# EAGLE design Heaters (EAGLE 7.7.0)

## Sheet 1 of 2
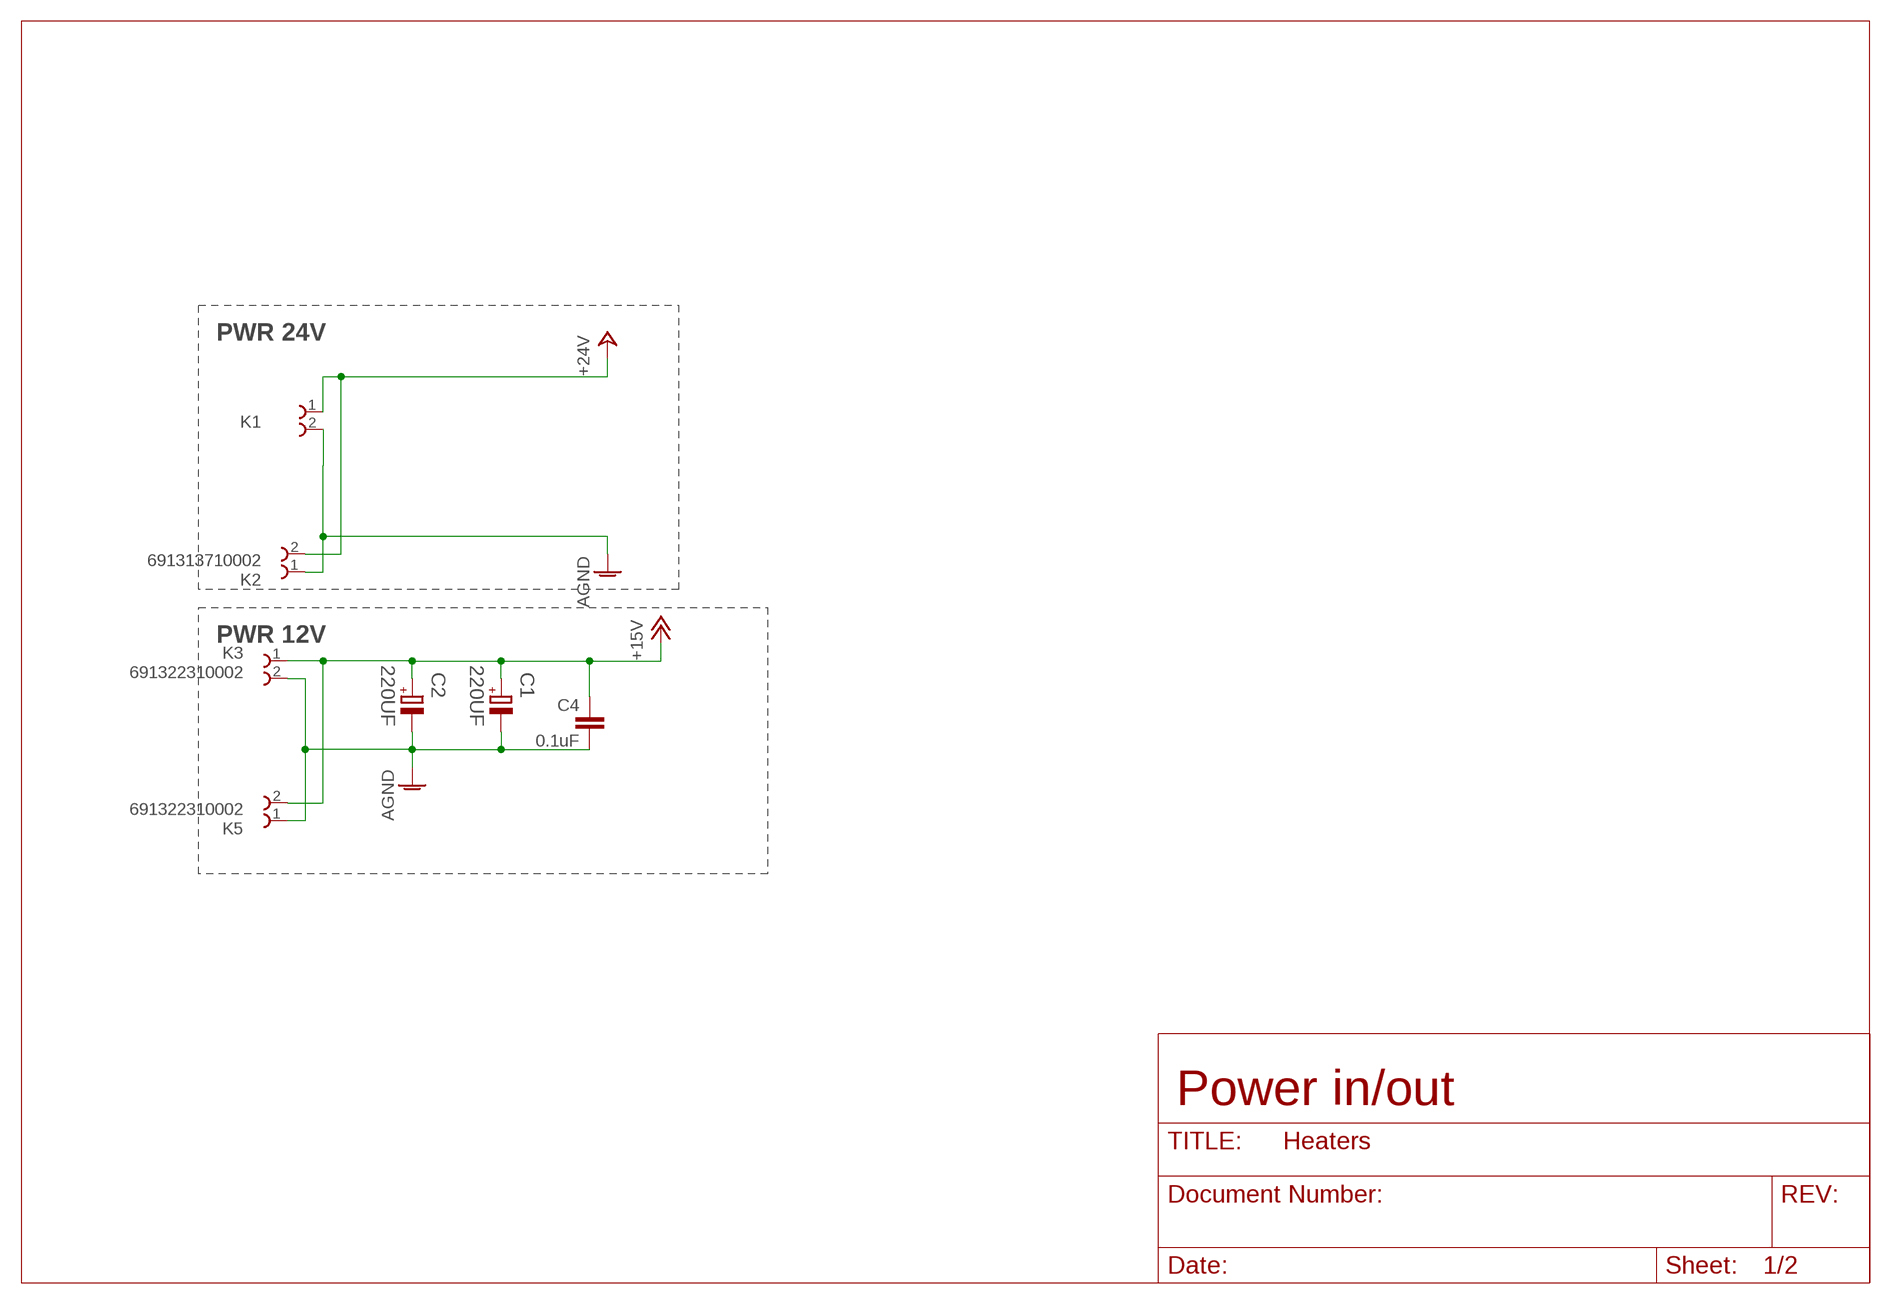
[diagram p0: schematic, sheet 1]

### Parts
C1  220UF  EEE-FP1V221AP-CASE-F  [CAPAE830X1050N]
C2  220UF  EEE-FP1V221AP-CASE-F  [CAPAE830X1050N]
C4  0.1uF  C-EUC0603K  [C0603K]
K1  691313710002  [691313710002]
K2  691313710002  [691313710002]
K3  691322310002  [691322310002]
K5  691322310002  [691322310002]

### Nets
+15V: C1.1 C2.1 C4.2 K3.1 K5.2 ; also sheet 2
+24V: K1.1 K2.2 ; also sheet 2
AGND: C1.2 C2.2 C4.1 K1.2 K2.1 K3.2 K5.1 ; also sheet 2

### Notes on the sheet
- PWR 24V
- PWR 12V
- Power in/out

## Sheet 2 of 2
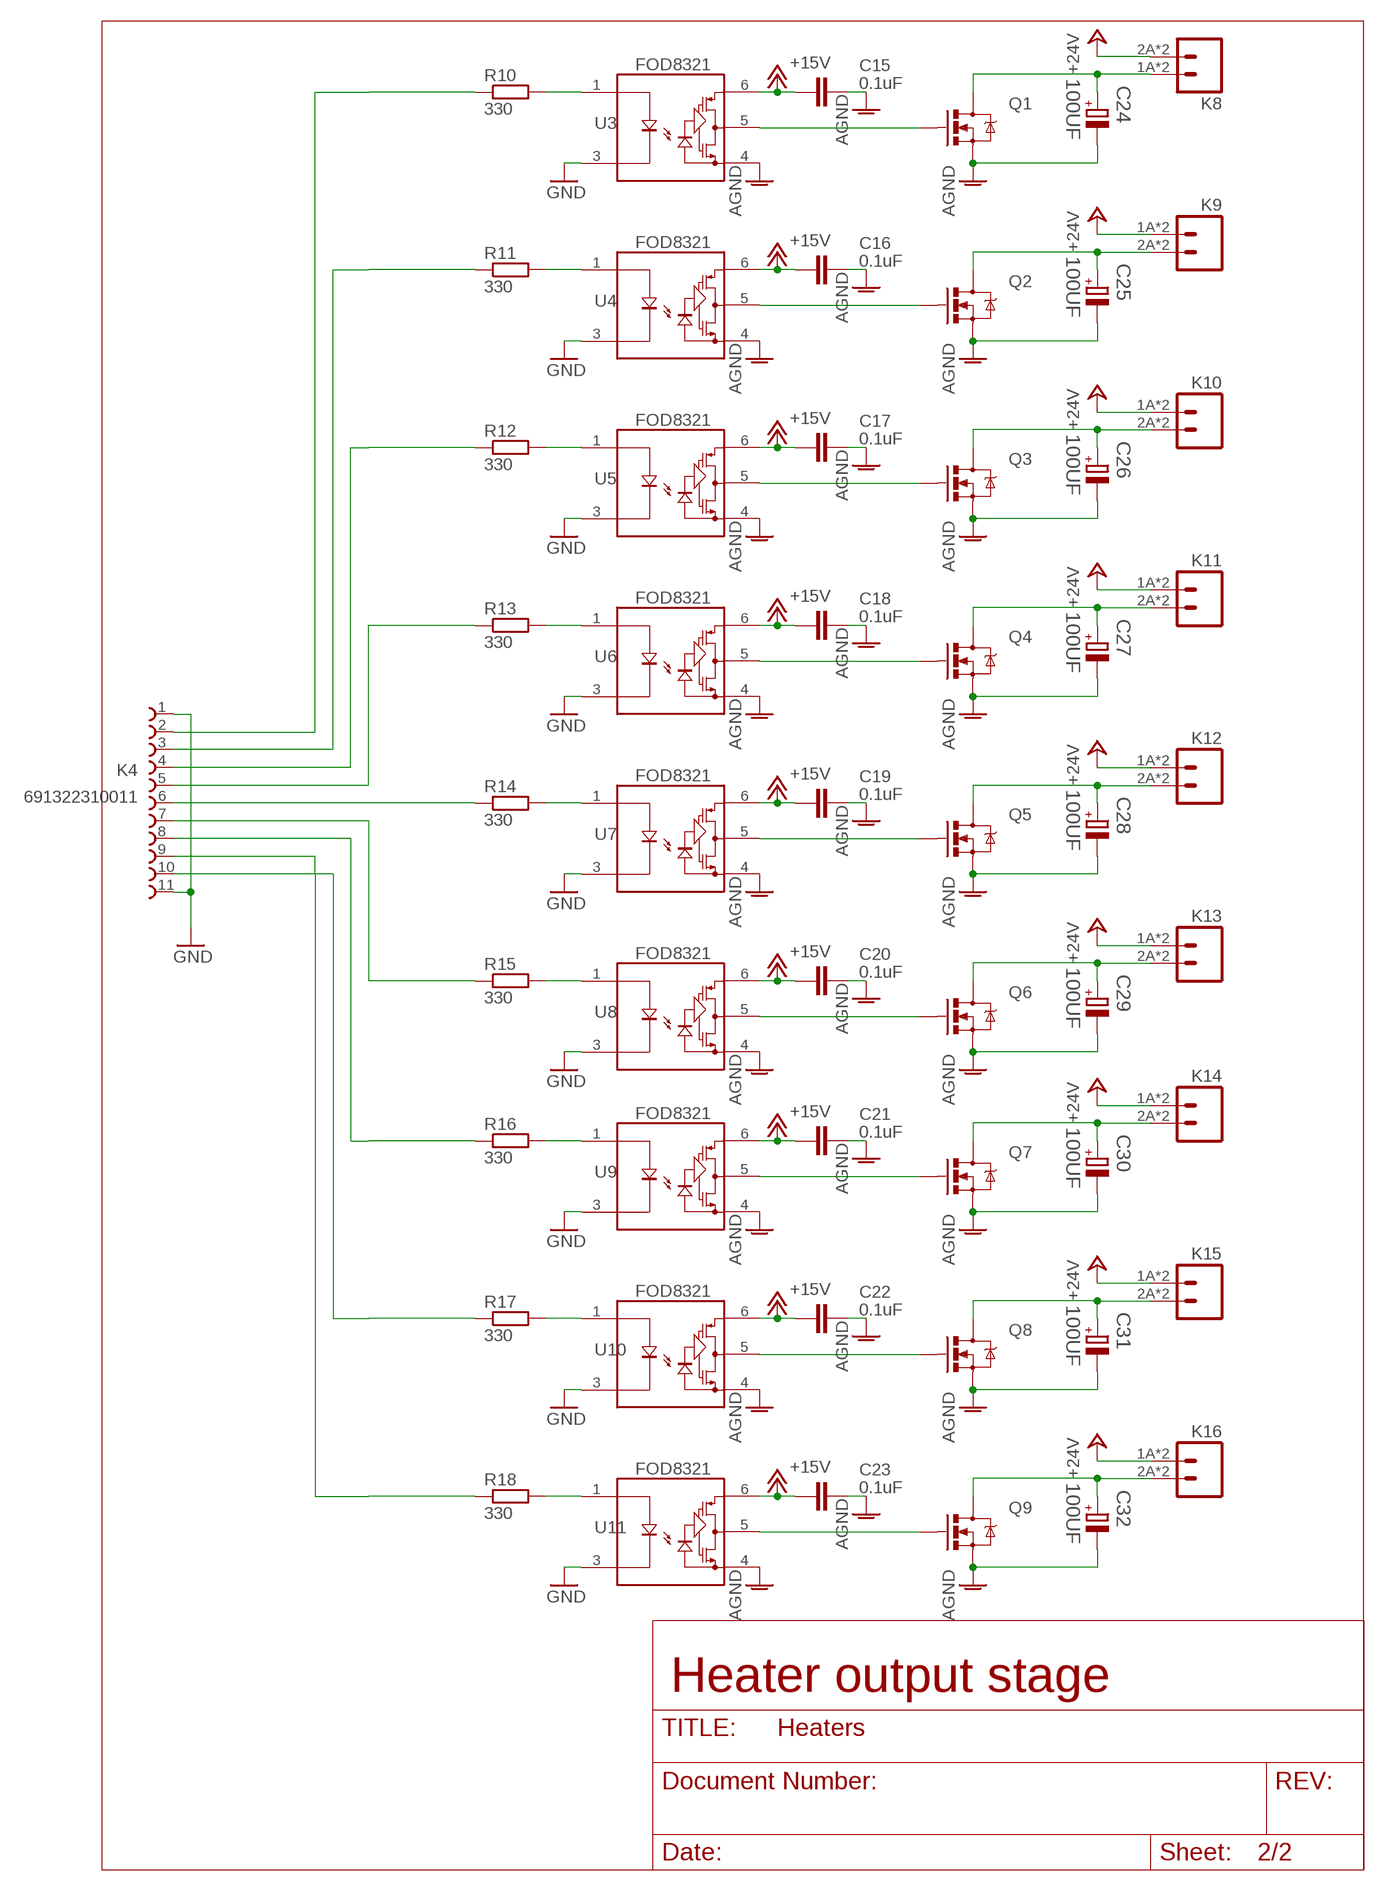
[diagram p1: schematic, sheet 2]

### Parts
C15  0.1uF  C-EUC1206K  [C1206K]
C16  0.1uF  C-EUC1206K  [C1206K]
C17  0.1uF  C-EUC1206K  [C1206K]
C18  0.1uF  C-EUC1206K  [C1206K]
C19  0.1uF  C-EUC1206K  [C1206K]
C20  0.1uF  C-EUC1206K  [C1206K]
C21  0.1uF  C-EUC1206K  [C1206K]
C22  0.1uF  C-EUC1206K  [C1206K]
C23  0.1uF  C-EUC1206K  [C1206K]
C24  100UF  EEE-FK2A101AM-CASE-J16  [CAPAE1700X1700N]
C25  100UF  EEE-FK2A101AM-CASE-J16  [CAPAE1700X1700N]
C26  100UF  EEE-FK2A101AM-CASE-J16  [CAPAE1700X1700N]
C27  100UF  EEE-FK2A101AM-CASE-J16  [CAPAE1700X1700N]
C28  100UF  EEE-FK2A101AM-CASE-J16  [CAPAE1700X1700N]
C29  100UF  EEE-FK2A101AM-CASE-J16  [CAPAE1700X1700N]
C30  100UF  EEE-FK2A101AM-CASE-J16  [CAPAE1700X1700N]
C31  100UF  EEE-FK2A101AM-CASE-J16  [CAPAE1700X1700N]
C32  100UF  EEE-FK2A101AM-CASE-J16  [CAPAE1700X1700N]
K4  691322310011  [691322310011]
K8  M02-MOLEX-104188-0210  [LITE-TRAP-CONNECTOR-2]
K9  M02-MOLEX-104188-0210  [LITE-TRAP-CONNECTOR-2]
K10  M02-MOLEX-104188-0210  [LITE-TRAP-CONNECTOR-2]
K11  M02-MOLEX-104188-0210  [LITE-TRAP-CONNECTOR-2]
K12  M02-MOLEX-104188-0210  [LITE-TRAP-CONNECTOR-2]
K13  M02-MOLEX-104188-0210  [LITE-TRAP-CONNECTOR-2]
K14  M02-MOLEX-104188-0210  [LITE-TRAP-CONNECTOR-2]
K15  M02-MOLEX-104188-0210  [LITE-TRAP-CONNECTOR-2]
K16  M02-MOLEX-104188-0210  [LITE-TRAP-CONNECTOR-2]
Q1  MOSFET-NCHANNEL-FDMS5672  [POWERPACK5060-8]
Q2  MOSFET-NCHANNEL-FDMS5672  [POWERPACK5060-8]
Q3  MOSFET-NCHANNEL-FDMS5672  [POWERPACK5060-8]
Q4  MOSFET-NCHANNEL-FDMS5672  [POWERPACK5060-8]
Q5  MOSFET-NCHANNEL-FDMS5672  [POWERPACK5060-8]
Q6  MOSFET-NCHANNEL-FDMS5672  [POWERPACK5060-8]
Q7  MOSFET-NCHANNEL-FDMS5672  [POWERPACK5060-8]
Q8  MOSFET-NCHANNEL-FDMS5672  [POWERPACK5060-8]
Q9  MOSFET-NCHANNEL-FDMS5672  [POWERPACK5060-8]
R10  330  R-EU_R0603  [R0603]
R11  330  R-EU_R0603  [R0603]
R12  330  R-EU_R0603  [R0603]
R13  330  R-EU_R0603  [R0603]
R14  330  R-EU_R0603  [R0603]
R15  330  R-EU_R0603  [R0603]
R16  330  R-EU_R0603  [R0603]
R17  330  R-EU_R0603  [R0603]
R18  330  R-EU_R0603  [R0603]
U3  FOD8321  [WB-SOP5]
U4  FOD8321  [WB-SOP5]
U5  FOD8321  [WB-SOP5]
U6  FOD8321  [WB-SOP5]
U7  FOD8321  [WB-SOP5]
U8  FOD8321  [WB-SOP5]
U9  FOD8321  [WB-SOP5]
U10  FOD8321  [WB-SOP5]
U11  FOD8321  [WB-SOP5]

### Nets
+15V: C15.1 C16.1 C17.1 C18.1 C19.1 C20.1 C21.1 C22.1 C23.1 U3.6(VDD) U4.6(VDD) U5.6(VDD) U6.6(VDD) U7.6(VDD) U8.6(VDD) U9.6(VDD) U10.6(VDD) U11.6(VDD) ; also sheet 1
+24V: K8.2A K8.2B K9.1A K9.1B K10.1A K10.1B K11.1A K11.1B K12.1A K12.1B K13.1A K13.1B K14.1A K14.1B K15.1A K15.1B K16.1A K16.1B ; also sheet 1
AGND: C15.2 C16.2 C17.2 C18.2 C19.2 C20.2 C21.2 C22.2 C23.2 C24.2 C25.2 C26.2 C27.2 C28.2 C29.2 C30.2 C31.2 C32.2 Q1.S1(S) Q1.S2(S) Q1.S3(S) Q2.S1(S) Q2.S2(S) Q2.S3(S) Q3.S1(S) Q3.S2(S) Q3.S3(S) Q4.S1(S) Q4.S2(S) Q4.S3(S) Q5.S1(S) Q5.S2(S) Q5.S3(S) Q6.S1(S) Q6.S2(S) Q6.S3(S) Q7.S1(S) Q7.S2(S) Q7.S3(S) Q8.S1(S) Q8.S2(S) Q8.S3(S) Q9.S1(S) Q9.S2(S) Q9.S3(S) U3.4(VSS) U4.4(VSS) U5.4(VSS) U6.4(VSS) U7.4(VSS) U8.4(VSS) U9.4(VSS) U10.4(VSS) U11.4(VSS) ; also sheet 1
GND: K4.1 K4.11 U3.3(K) U4.3(K) U5.3(K) U6.3(K) U7.3(K) U8.3(K) U9.3(K) U10.3(K) U11.3(K)
N$1: R18.2 U11.1(A)
N$2: R17.2 U10.1(A)
N$3: C24.1 K8.1A K8.1B Q1.D5(D) Q1.D6(D) Q1.D7(D) Q1.D8(D) Q1.DPAD(D)
N$4: R11.2 U4.1(A)
N$6: C25.1 K9.2A K9.2B Q2.D5(D) Q2.D6(D) Q2.D7(D) Q2.D8(D) Q2.DPAD(D)
N$7: R12.2 U5.1(A)
N$8: C26.1 K10.2A K10.2B Q3.D5(D) Q3.D6(D) Q3.D7(D) Q3.D8(D) Q3.DPAD(D)
N$9: R13.2 U6.1(A)
N$10: R10.2 U3.1(A)
N$11: C27.1 K11.2A K11.2B Q4.D5(D) Q4.D6(D) Q4.D7(D) Q4.D8(D) Q4.DPAD(D)
N$12: R14.2 U7.1(A)
N$13: C28.1 K12.2A K12.2B Q5.D5(D) Q5.D6(D) Q5.D7(D) Q5.D8(D) Q5.DPAD(D)
N$14: R15.2 U8.1(A)
N$15: C29.1 K13.2A K13.2B Q6.D5(D) Q6.D6(D) Q6.D7(D) Q6.D8(D) Q6.DPAD(D)
N$16: R16.2 U9.1(A)
N$17: C30.1 K14.2A K14.2B Q7.D5(D) Q7.D6(D) Q7.D7(D) Q7.D8(D) Q7.DPAD(D)
N$18: C31.1 K15.2A K15.2B Q8.D5(D) Q8.D6(D) Q8.D7(D) Q8.D8(D) Q8.DPAD(D)
N$19: C32.1 K16.2A K16.2B Q9.D5(D) Q9.D6(D) Q9.D7(D) Q9.D8(D) Q9.DPAD(D)
PWM_DOT1: K4.10 R17.1
PWM_DOT2: K4.9 R18.1
PWM_SEG1: K4.2 R10.1
PWM_SEG2: K4.3 R11.1
PWM_SEG3: K4.4 R12.1
PWM_SEG4: K4.5 R13.1
PWM_SEG5: K4.6 R14.1
PWM_SEG6: K4.7 R15.1
PWM_SEG7: K4.8 R16.1
VO: Q1.G4(G) U3.5(VO)
VO1: Q2.G4(G) U4.5(VO)
VO2: Q3.G4(G) U5.5(VO)
VO3: Q4.G4(G) U6.5(VO)
VO4: Q5.G4(G) U7.5(VO)
VO5: Q6.G4(G) U8.5(VO)
VO6: Q7.G4(G) U9.5(VO)
VO7: Q9.G4(G) U11.5(VO)
VO8: Q8.G4(G) U10.5(VO)

### Notes on the sheet
- Heater output stage

## Library data of the parts
C1 C2 = Panasonic-EEEFK_EEEFP:EEE-: Aluminum Electrolytic Capacitors,Surface Mount Type; MPN: EEE-FP1V221AP; OC_FARNELL: 1539514; OC_NEWARK: 94M7043; PACKAGE: CASE-F; SUPPLIER: PANASONIC; TOLERANCE: ±20 %; VOLTAGERATING: 35V
C4 C15-C23 = rcl:C-EU: CAPACITOR, European symbol
C24-C32 = Panasonic-EEEFK_EEEFP:EEE-: Aluminum Electrolytic Capacitors,Surface Mount Type; MPN: EEE-FK2A101AM; OC_FARNELL: 2284678; OC_NEWARK: 53W3690; PACKAGE: CASE-J16; SUPPLIER: PANASONIC; TOLERANCE: ±20 %; VOLTAGERATING: 100V
K1 K2 = Wurth_Elektronik_Electromechanic_Terminal_Blocks_Connectors_rev15d:691313710002: WR-TBL Serie 3137 - 5.0mm Close Horizontal PCB Header , 2 Pins=>Code : Con_TBL_Pluggable_5.00_PCB_H_691313710002 <http://katalog.we-online.de/media/images/eican/Con_TBL_Pluggable_5.00_PCB_H_6913137100xx_pf2.jpg> Details see: http://katalog.we-online.de/en/em/691_313_710_0xx Created 2014-06-19, Karrer Zheng 2014 (C) Würth Elektronik
K3 K5 = Wurth_Elektronik_Electromechanic_Terminal_Blocks_Connectors_rev15d:691322310002: WR-TBL Serie 322 - 3.81mm Vertical PCB Header , 2 Pins=>Code : Con_TBL_Pluggable_3.81_PCB_THT_Simple_691322310002 <http://katalog.we-online.de/media/images/eican/Con_TBL_Pluggable_3.81_PCB_THT_Simple_6913223100xx_pf2.jpg> Details see: http://katalog.we-online.de/en/em/691_322_310_0xx Created 2014-06-19, Karrer Zheng 2014 (C) Würth Elektronik
K4 = Wurth_Elektronik_Electromechanic_Terminal_Blocks_Connectors_rev15d:691322310011: WR-TBL Serie 322 - 3.81mm Vertical PCB Header , 11 Pins=>Code : Con_TBL_Pluggable_3.81_PCB_THT_Simple_691322310011 <http://katalog.we-online.de/media/images/eican/Con_TBL_Pluggable_3.81_PCB_THT_Simple_6913223100xx_pf2.jpg> Details see: http://katalog.we-online.de/en/em/691_322_310_0xx Created 2014-06-19, Karrer Zheng 2014 (C) Würth Elektronik
K8-K16 = simbits:M02: Standard 2-pin 0.1" header. Use with - straight break away headers ( PRT-00116) - right angle break away headers (PRT-00553) - swiss pins (PRT-00743) - machine pins (PRT-00117) - female headers (PRT-00115) Molex polarized connector foot print use with: PRT-08233 with associated crimp pins and housings. 2.54_SCREWTERM for use with PRT-10571. 3.5mm Screw Terminal footprints for PRT-08084 5mm Screw Terminal footprints for use with PRT-08432
Q1-Q9 = simbits:MOSFET-NCHANNEL: Common NMOSFET Parts MFG P/N Store ID Prod ID FDD8780 TRANS-09984 SI7820DN TRANS-11055 FDS6630A IC-08089 2N7002PW TRANS-11151 FQP30N06L COM-10213 TRANS-10060 BSS123LT1G TRANS-08345 BSS138 TRANS-00830 BS170 2N7000
R10-R18 = rcl:R-EU_: RESISTOR, European symbol
U3-U11 = simbits:FOD8321: Fairchild FOD8321 2.5A Output Current, Gate Drive Optocoupler in Optoplanar® Wide Body SOP 5-Pin Push-Pull output

## Board
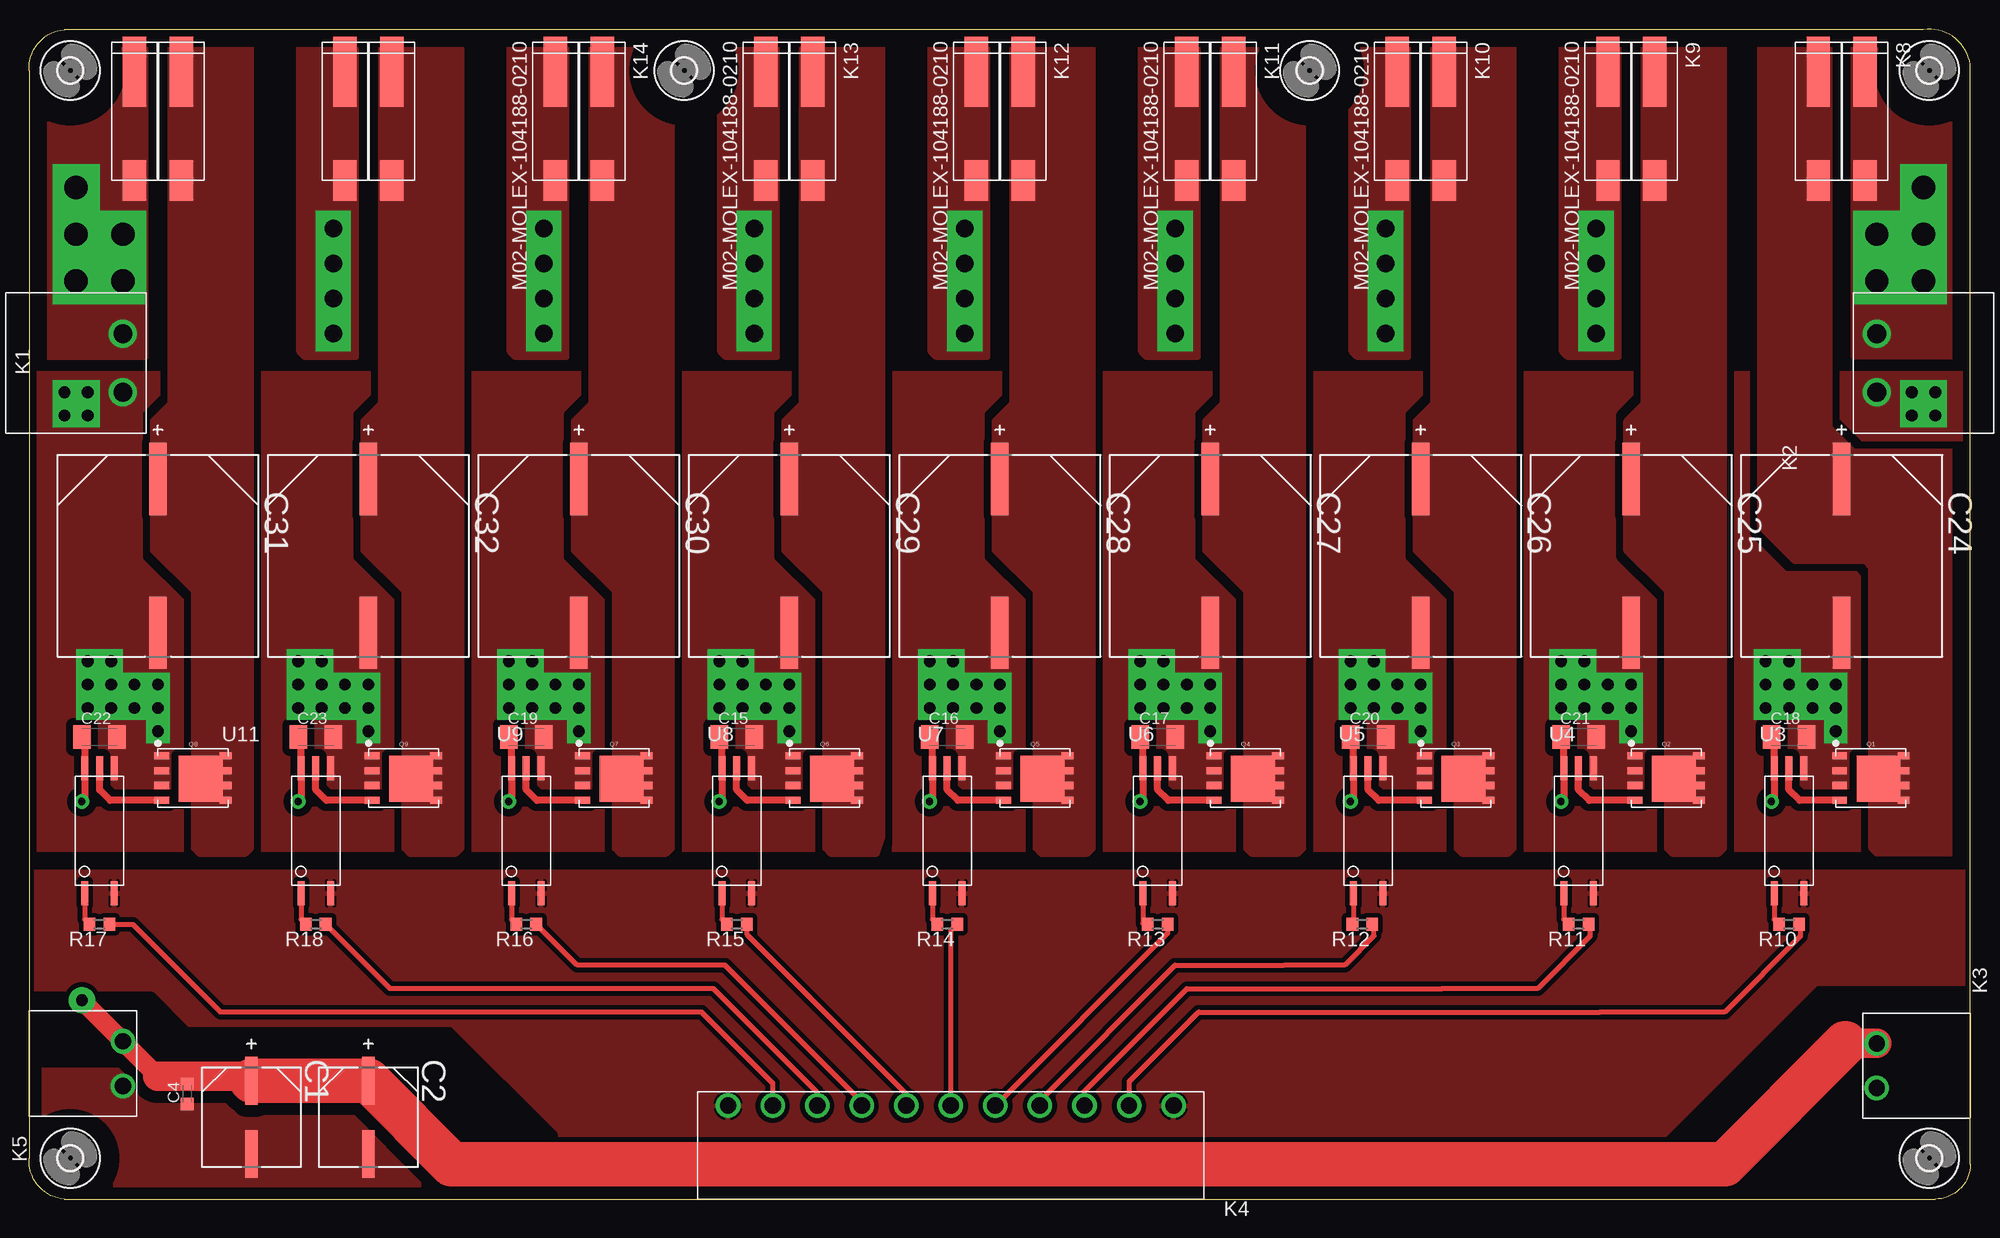
[diagram p2: board, top side]
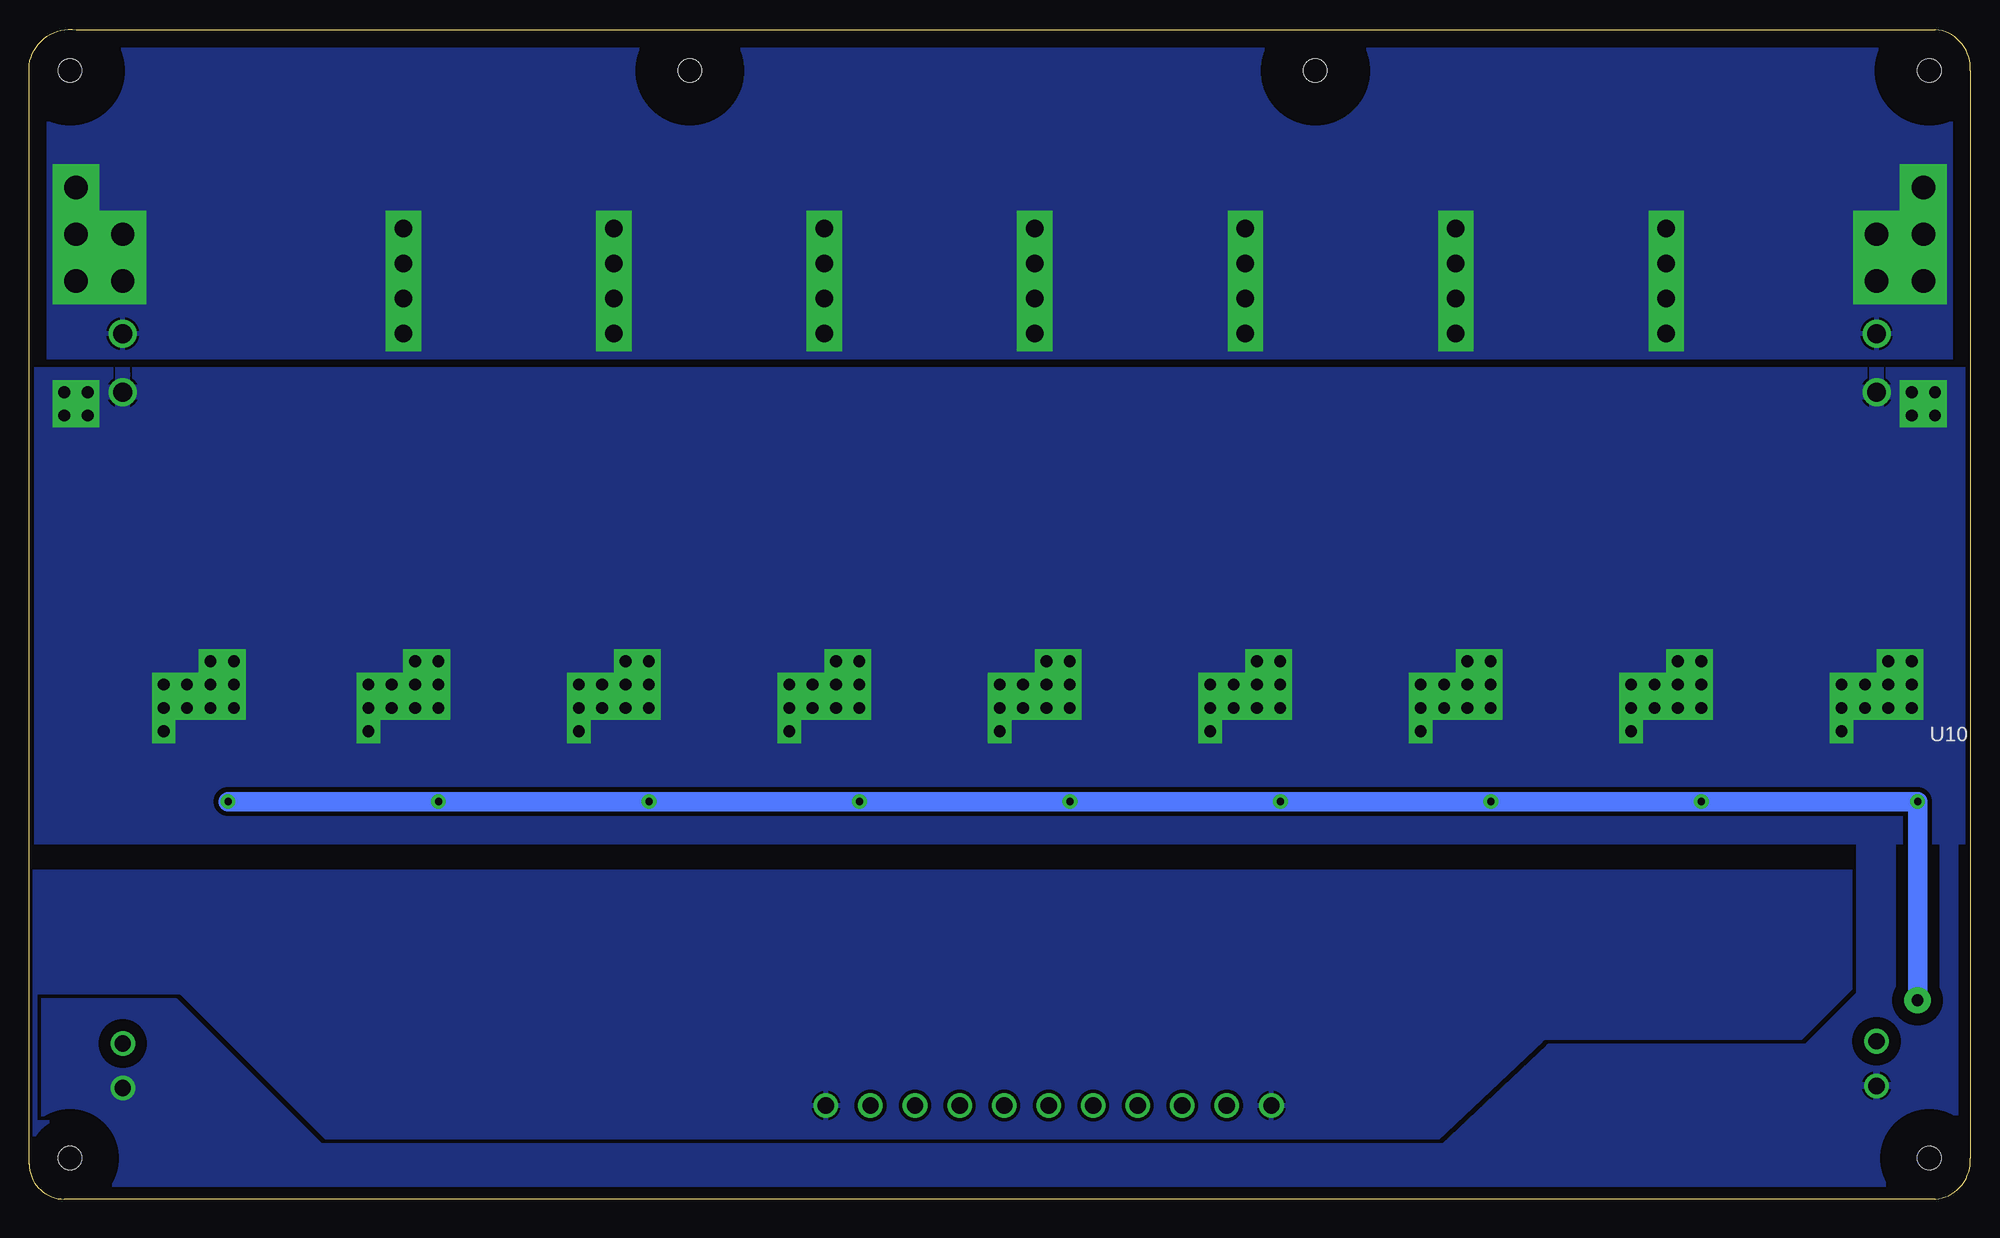
[diagram p3: board, bottom side, seen from below]

Size 166.01 x 100.03 mm. Coordinates in mm from the lower left corner, seen from the top.
Outline: 3.01,0 163.01,0 arc90 166.01,3 166.01,97 arc90 162.01,100 3.01,100 arc90 0.01,96.5 0.01,3.5 arc90 3.01,0
Copper layers (1*16): Top 0.035mm / dielectric 1.55mm / Bottom 0.035mm
Design rules "eC_2Layer_PClass6_BaseCopperO35 *": minimum track width 0.15mm, minimum drill 0.35mm, track to track 0.175mm, track to pad 0.175mm, pad to pad 0.175mm, via to via 0.175mm, smd to smd 0mil, copper to edge 0.25mm, drill to drill 0.35mm, minimum pad ring 0.175mm, minimum via ring 0.125mm, stop-mask expansion 0mil, vias tented up to drill 0.45mm, thermal gap 0.2mm

### Footprints (pad centres in the part's own frame; a part is rotated, then mirrored left to right if it is on the bottom)
2,0 = hole 2: 0,0
CAPAE830X1050N = smd 4.064 x 1.092: 1 -3.124,0; 2 3.124,0
C0603K = smd 1.05 x 1.08: 1 -0.875,0; 2 0.875,0
C1206K = smd 1.5 x 2: 1 -1.5,0; 2 1.5,0
CAPAE1700X1700N = smd 6.172 x 1.499: 1 -6.579,0; 2 6.579,0
691313710002 = drill 1.6: 1 -5,0; 2 0,0
691322310002 = drill 1.4: 1 -3.81,0; 2 0,0
691322310011 = drill 1.4: 1 -22.86,0; 2 -19.05,0; 3 -15.24,0; 4 -11.43,0; 5 -7.62,0; 6 -3.81,0; 7 0,0; 8 3.81,0; 9 7.62,0; 10 11.43,0; 11 15.24,0
LITE-TRAP-CONNECTOR-2 = smd 6 x 2: 1A -3.4,-2; 2A -3.4,2 | smd 3.5 x 2: 1B 5.9,-2; 2B 5.9,2
POWERPACK5060-8 = smd 1.02 x 0.61: D5 2.79,-1.905; D8 2.79,1.905 | smd 0.77 x 0.61: D6 2.915,-0.635; D7 2.915,0.635 | smd 3.75 x 3.91: DPAD 0.65,-0.05 | smd 1.27 x 0.61: G4 -2.675,-1.905; S1 -2.675,1.905; S2 -2.675,0.635; S3 -2.675,-0.635
R0603 = smd 1 x 1.1: 1 -0.85,0; 2 0.85,0
WB-SOP5 = smd 0.6 x 2.05: 1 -1.27,-5.35; 3 1.27,-5.35; 4 1.27,5.35; 5 0,5.35; 6 -1.27,5.35

### Placement (x,y rotation side)
$2_206_$_2016-11-07_20-18-07  MOUNT-HOLE2.0  [2,0]  3.51,96.5 0 top
C1  19.01,7 270 top
C2  29.01,7 270 top
C4  13.51,9 90 top
C15  60.51,39.5 0 top
C16  78.51,39.5 0 top
C17  96.51,39.5 0 top
C18  150.51,39.5 0 top
C19  42.51,39.5 0 top
C20  114.51,39.5 0 top
C21  132.51,39.5 0 top
C22  6.01,39.5 0 top
C23  24.51,39.5 0 top
C24  155.01,55 270 top
C25  137.01,55 270 top
C26  119.01,55 270 top
C27  101.01,55 270 top
C28  83.01,55 270 top
C29  65.01,55 270 top
C30  47.01,55 270 top
C31  11.01,55 270 top
C32  29.01,55 270 top
H1  MOUNT-HOLE2.0  [2,0]  3.51,3.5 0 top
H2  MOUNT-HOLE2.0  [2,0]  162.51,3.5 0 top
H6  MOUNT-HOLE2.0  [2,0]  162.51,96.5 0 top
H7  MOUNT-HOLE2.0  [2,0]  56.01,96.5 0 top
H8  MOUNT-HOLE2.0  [2,0]  109.51,96.5 0 top
K1  8.01,69 270 top
K2  158.01,74 90 top
K3  158.01,9.5 270 top
K4  75.01,8 180 top
K5  8.01,13.5 90 top
K8  155.01,93 270 top
K9  137.01,93 270 top
K10  119.01,93 270 top
K11  101.01,93 270 top
K12  83.01,93 270 top
K13  65.01,93 270 top
K14  47.01,93 270 top
K15  11.01,93 270 top
K16  29.01,93 270 top
Q1  157.51,36 0 top
Q2  140.01,36 0 top
Q3  122.01,36 0 top
Q4  104.01,36 0 top
Q5  86.01,36 0 top
Q6  68.01,36 0 top
Q7  50.01,36 0 top
Q8  14.01,36 0 top
Q9  32.01,36 0 top
R10  150.51,23.5 180 top
R11  132.51,23.5 180 top
R12  114.01,23.5 180 top
R13  96.51,23.5 180 top
R14  78.51,23.5 180 top
R15  60.51,23.5 180 top
R16  42.51,23.5 180 top
R17  6.01,23.5 180 top
R18  24.51,23.5 180 top
U3  150.51,31.5 0 top
U4  132.51,31.5 0 top
U5  114.51,31.5 0 top
U6  96.51,31.5 0 top
U7  78.51,31.5 0 top
U8  60.51,31.5 0 top
U9  42.51,31.5 0 top
U10  6.01,31.5 0 top
U11  24.51,31.5 0 top

### Tracks (layer width: path | path; a pad name or v marks a point on that pad's centre or on a via)
+15V  (via drill 0.6 pad 1.27, 1 pad 2.25)
  Top 0.406: C4.2 10.63,9.88 10.51,10 11.01,10.5
  Top 0.61: C22.1 4.74,39.77 U10.6 4.74,34.23 v4.51,34 | v23.01,34 23.24,34.23 U11.6 23.24,39.77 C23.1 | v41.01,34 41.24,34.23 U9.6 41.24,39.77 C19.1 | v59.01,34 59.24,34.23 U8.6 59.24,39.77 C15.1 | v77.01,34 77.24,34.23 U7.6 77.24,39.77 C16.1 | v95.01,34 95.24,34.23 U6.6 95.24,39.77 C17.1 | v113.01,34 113.24,34.23 U5.6 113.24,39.77 C20.1 | v131.01,34 131.24,34.23 U4.6 131.24,39.77 C21.1 | v149.01,34 149.24,34.23 U3.6 149.24,39.77 C18.1
  Top 1.676: v4.51,17 K5.2 11.01,10.5 | 19.13,10.5 C1.1
  Top 2.54: 11.01,10.5 16.63,10.5 19.13,10.5 | K3.1 155.32,13.31
  Top 3.81: C1.1 C2.1 36.13,3 145.01,3 155.32,13.31
  Bottom 0.61: v23.01,34 22.51,34 | v41.01,34 40.51,34 | v59.01,34 58.51,34 | v77.01,34 76.51,34 | v95.01,34 94.51,34 | v113.01,34 112.51,34 | v131.01,34 130.51,34 | v149.01,34 148.51,34
  Bottom 1.676: v4.51,17 v4.51,34 22.51,34 v23.01,34 40.51,34 v41.01,34 58.51,34 v59.01,34 76.51,34 v77.01,34 94.51,34 v95.01,34 112.51,34 v113.01,34 130.51,34 v131.01,34 148.51,34 v149.01,34
+24V  (via drill 1.5 pad 3, 2 pad 4)
  other vias: 4.01,86.5 4.01,82.5 8.01,82.5 26.01,77 26.01,80 26.01,83 44.01,83 44.01,80 44.01,77 62.01,83 62.01,80 62.01,77 80.01,83 80.01,80 80.01,77 98.01,83 98.01,80 98.01,77 116.01,83 116.01,80 116.01,77 134.01,83 134.01,80 134.01,77 8.01,78.5 4.01,78.5 162.01,86.5 162.01,82.5 158.01,82.5 158.01,78.5 162.01,78.5 80.01,74 26.01,74 44.01,74 62.01,74 98.01,74 116.01,74 134.01,74
  pour Top (isolate 1.5, no thermals): -0.99,100.5 -0.49,74.5 -0.99,72 10.01,72 10.01,100.5
  pour Top (isolate 1.5, no thermals): 23.01,100.5 23.01,72.5 23.51,72 28.01,72 28.01,100.5
  pour Bottom (isolate 1.5): -4.99,72 170.01,72 170.01,102 165.01,107 0.01,107 -4.99,102 -4.99,77.93 -5.04,72.98
  pour Top (isolate 1.5, no thermals): 167.01,100.5 166.51,74.5 167.01,72 156.01,72 156.01,100.5
  pour Top (isolate 1.5, no thermals): 41.01,100.5 41.01,72.5 41.51,72 46.01,72 46.01,100.5
  pour Top (isolate 1.5, no thermals): 59.01,100.5 59.01,72.5 59.51,72 64.01,72 64.01,100.5
  pour Top (isolate 1.5, no thermals): 77.01,100.5 77.01,72.5 77.51,72 82.01,72 82.01,100.5
  pour Top (isolate 1.5, no thermals): 95.01,100.5 95.01,72.5 95.51,72 100.01,72 100.01,100.5
  pour Top (isolate 1.5, no thermals): 113.01,100.5 113.01,72.5 113.51,72 118.01,72 118.01,100.5
  pour Top (isolate 1.5, no thermals): 131.01,100.5 131.01,72.5 131.51,72 136.01,72 136.01,100.5
AGND  (via drill 1 pad 2)
  other vias: 47.01,40 47.01,42 47.01,44 45.01,44 45.01,42 43.01,42 43.01,44 41.01,44 41.01,42 43.01,46 41.01,46 154.51,40 154.51,42 154.51,44 152.51,44 152.51,42 150.51,42 150.51,44 148.51,44 148.51,42 150.51,46 148.51,46 137.01,40 137.01,42 137.01,44 135.01,44 135.01,42 133.01,42 133.01,44 131.01,44 131.01,42 133.01,46 131.01,46 119.01,40 119.01,42 119.01,44 117.01,44 117.01,42 115.01,42 115.01,44 113.01,44 113.01,42 115.01,46 113.01,46 101.01,40 101.01,42 101.01,44 99.01,44 99.01,42 97.01,42 97.01,44 95.01,44 95.01,42 97.01,46 95.01,46 83.01,40 83.01,42 83.01,44 81.01,44 81.01,42 79.01,42 79.01,44 77.01,44 77.01,42 79.01,46 77.01,46 65.01,40 65.01,42 65.01,44 63.01,44 63.01,42 61.01,42 61.01,44 59.01,44 59.01,42 61.01,46 59.01,46 29.01,40 29.01,42 29.01,44 27.01,44 27.01,42 25.01,42 25.01,44 23.01,44 23.01,42 25.01,46 23.01,46 11.01,40 11.01,42 11.01,44 9.01,44 9.01,42 7.01,42 7.01,44 5.01,44 5.01,42 7.01,46 5.01,46 161.01,69 163.01,69 161.01,67 5.01,69 3.01,69 5.01,67 163.01,67 3.01,67
  pour Bottom (isolate 0.406, rank 6): -0.49,70.5 166.51,70.5 168.01,69 167.51,32 169.01,31 -2.49,31 -2.49,32 -0.99,70
  pour Top (isolate 0.61, rank 6, no thermals): 167.01,70.5 0.01,70.5 -1.49,69 -1.49,30 166.01,30 167.01,31.5 167.51,70
  pour Bottom (isolate 1.016): -1.49,31 9.51,31 9.51,17.5 14.01,13 36.01,13 45.01,4.5 170.51,4.5 171.01,-1.5 1.01,-1.5 -2.49,2 -2.49,30
  pour Top (isolate 1.016, no thermals): -1.49,16.5 10.01,16.5 13.01,13.5 35.51,13.5 44.51,4.5 172.51,4.5 173.01,-1.5 2.01,-1 -0.99,-0.5 -1.99,14.5
  cutout Top (isolate 1.016): 167.51,18 153.01,18 138.51,3.5 139.51,-1 165.01,-1 167.51,1.5
  pour Bottom (isolate 1.016, no thermals): 173.01,17 153.51,17 140.01,3.5 140.01,-4 165.01,-3 170.51,-1 172.01,3 173.01,12
GND
  pour Top (isolate 0.406, rank 6): -0.49,28 168.51,28 168.51,2 165.51,-1 2.01,-1 -1.49,2.5 -1.49,28.5
  pour Bottom (isolate 0.305, rank 6): 168.01,28 -0.99,28 -0.99,2 2.01,-1 165.51,-1 169.01,2.5 169.01,27.5
N$1
  Top 0.406: U11.1 23.24,23.92 R18.2
N$2
  Top 0.406: U10.1 4.74,23.92 R17.2
N$3
  pour Top (isolate 1.5, rank 5, no thermals): 154.01,100 154.01,66 156.01,64 166.51,64 166.51,29.5 158.01,29.5 157.51,30 157.51,54 157.01,54.5 151.01,54.5 148.01,57.5 148.01,100.5 153.51,100.5
N$4
  Top 0.406: U4.1 131.24,23.92 R11.2
N$5
  cutout Top (isolate 1.5): 0.01,17 0.01,12 0.51,11.5 29.51,11.5 36.51,4.5 44.01,4.5 45.01,5.5 36.01,14.5 13.51,14.5 10.51,17.5 -0.49,17.5
N$6
  pour Top (isolate 1.5, rank 5, no thermals): 138.01,100 138.01,68 136.51,66.5 136.51,55.5 140.01,52 140.01,30 140.51,29.5 144.51,29.5 145.01,30 145.01,100.5 138.51,100.5
N$7
  Top 0.406: U5.1 113.24,23.92 R12.2
N$8
  pour Top (isolate 1.5, rank 5, no thermals): 120.01,100 120.01,68 118.51,66.5 118.51,55.5 122.01,52 122.01,30 122.51,29.5 126.51,29.5 127.01,30 127.01,100 120.51,100.5
N$9
  Top 0.406: U6.1 95.24,25.62 95.24,23.58 R13.2
N$10
  Top 0.406: U3.1 149.24,23.92 R10.2
N$11
  pour Top (isolate 1.5, rank 5, no thermals): 102.01,100 102.01,68 100.51,66.5 100.51,55.5 104.01,52 104.01,30 104.51,29.5 108.51,29.5 109.01,30 109.01,100.5 102.51,100.5
N$12
  Top 0.406: U7.1 77.24,23.92 R14.2
N$13
  pour Top (isolate 1.5, rank 5, no thermals): 84.01,100 84.01,68 82.51,66.5 82.51,55.5 86.01,52 86.01,30 86.51,29.5 90.51,29.5 91.01,30 91.01,100.5 84.51,100.5
N$14
  Top 0.406: U8.1 59.24,23.92 R15.2
N$15
  pour Top (isolate 1.5, rank 5, no thermals): 66.01,100 66.01,68 64.51,66.5 64.51,55.5 68.01,52 68.01,30 68.51,29.5 72.51,29.5 73.01,31 73.01,101 66.51,100.5
N$16
  Top 0.406: U9.1 41.24,23.92 R16.2
N$17
  pour Top (isolate 1.5, rank 5, no thermals): 48.01,100 48.01,68 46.51,66.5 46.51,55.5 50.01,52 50.01,30 50.51,29.5 54.51,29.5 55.01,30 55.01,100.5 48.51,100.5
N$18
  pour Top (isolate 1.5, rank 5, no thermals): 12.01,100 12.01,68 10.51,66.5 10.51,55.5 14.01,52 14.01,30 14.51,29.5 18.51,29.5 19.01,30 19.01,100.5 12.51,100.5
N$19
  pour Top (isolate 1.5, rank 5, no thermals): 30.01,100 30.01,68 28.51,66.5 28.51,55.5 32.01,52 32.01,30 32.51,29.5 36.51,29.5 37.01,30 37.01,101 30.51,100.5
PWM_DOT1
  Top 0.406: K4.10 63.58,9.93 57.51,16 16.36,16 8.86,23.5 R17.1
PWM_DOT2
  Top 0.406: R18.1 30.86,18 58.51,18 67.39,9.12 K4.9
PWM_SEG1
  Top 0.406: R10.1 151.51,23.35 151.51,22.5 145.01,16 134.36,16 100.01,16 94.06,10.05 K4.2
PWM_SEG2
  Top 0.406: R11.1 133.51,23.35 133.51,22.5 129.01,18 120.86,18 99.01,18 90.25,9.24 K4.3
PWM_SEG3
  Top 0.406: R12.1 115.01,23.35 115.01,22.5 112.51,20 107.36,20 98.01,20 86.44,8.43 K4.4
PWM_SEG4
  Top 0.406: R13.1 97.36,22.73 K4.5
PWM_SEG5
  Top 0.406: R14.1 78.93,23.07 | 78.93,23.07 78.82,22.96 | K4.6 78.82,22.96 | 78.82,22.96 78.93,23.07
PWM_SEG6
  Top 0.406: R15.1 61.36,22.65 75.01,9 K4.7
PWM_SEG7
  Top 0.406: R16.1 46.86,20 59.51,20 71.2,8.31 K4.8
VO
  Top 0.61: Q1.G4 151.41,34.09 150.51,35 U3.5
VO1
  Top 0.61: Q2.G4 133.41,34.09 132.51,35 U4.5
VO2
  Top 0.61: Q3.G4 115.41,34.09 114.51,35 U5.5
VO3
  Top 0.61: Q4.G4 97.41,34.09 96.51,35 U6.5
VO4
  Top 0.61: Q5.G4 79.41,34.09 78.51,35 U7.5
VO5
  Top 0.61: Q6.G4 61.41,34.09 60.51,35 U8.5
VO6
  Top 0.61: Q7.G4 43.41,34.09 42.51,35 U9.5
VO7
  Top 0.61: Q9.G4 25.41,34.09 24.51,35 U11.5
VO8
  Top 0.61: U10.5 6.01,35 6.91,34.09 Q8.G4